# Altium schematic sheet PowerReceiver.SchDoc
size A4
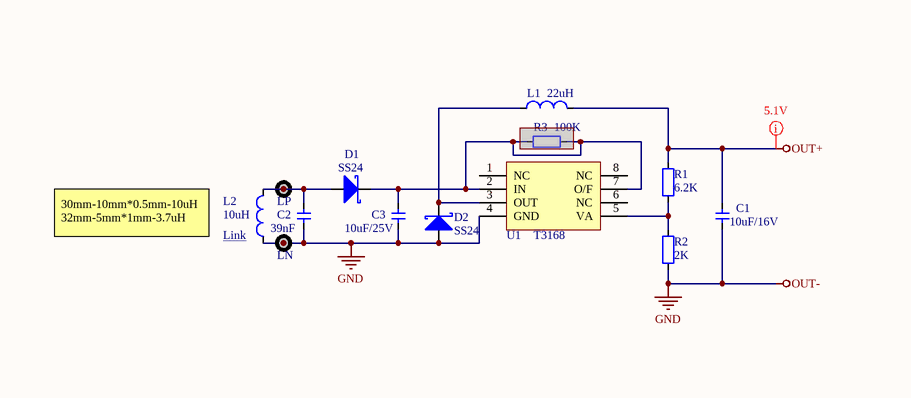
[diagram p0: PowerReceiver.SchDoc]

## Parts
C1  10uF/16V  [CAP_1206]
C2  39nF  [CAP_1206]
C3  10uF/25V  [CAP_1206]
D1  SS24  [DO-214AC]
D2  SS24  [DO-214AC]
L1  22uH  [IND_0403]
L2  10uH  [IND_1210]
LN  TestPoint  [TestPoint_0.8mm]  (value not drawn)
LP  TestPoint  [TestPoint_0.8mm]  (value not drawn)
R1  value 6.2K  [RES_0603]  (hidden comment: Res_0603)
R2  value 2K  [RES_0603]  (hidden comment: Res_0603)
R3  100K  [RES_0603]  (masked out: inside a compile mask, not in the netlist)
U1  T3168  [SOIC_8]

## Nets
GND: C1.1 C2.1 C3.1 D2.1(A) L2.1 LN.1(TP) R2.1 U1.4(GND)  [also labelled OUT-]
OUT+: C1.2 L1.2 R1.2
NetC2_2: C2.2 D1.1(A) L2.2 LP.1(TP)
NetC3_2: C3.2 D1.2(K) U1.2(IN) U1.7(O/F)
NetD2_2: D2.2(K) L1.1 U1.3(OUT)
NetR1_1: R1.1 R2.2 U1.5(VA)

Not connected (* = marked no-connect by the designer): U1 1(NC) 6(NC) 8(NC)

## Layout directives
mark named 5.1V: OUT+

## Notes on the sheet
- 30mm-10mm*0.5mm-10uH
  32mm-5mm*1mm-3.7uH
- (near L2) Link <https://item.taobao.com/item.htm?spm=a1z0d.6639537.1997196601.58.swHxrp&id=529508692700>

## Library data of the parts
C1-C3 = Cap_1206: Capacitor; Value: ?F
D1 D2 = Diode_Schottky: Diode
L1 L2 = Ind_1210: Inductor; Value: ?H
R1 R2 = Res_0603: Resistor
R3 = Res_0603: Resistor; Value: ?K
U1 = T3168: Wireless charging reciver